# Altium schematic sheet Sheet1.SchDoc
size A4; SheetNumber: 1; SheetTotal: 2
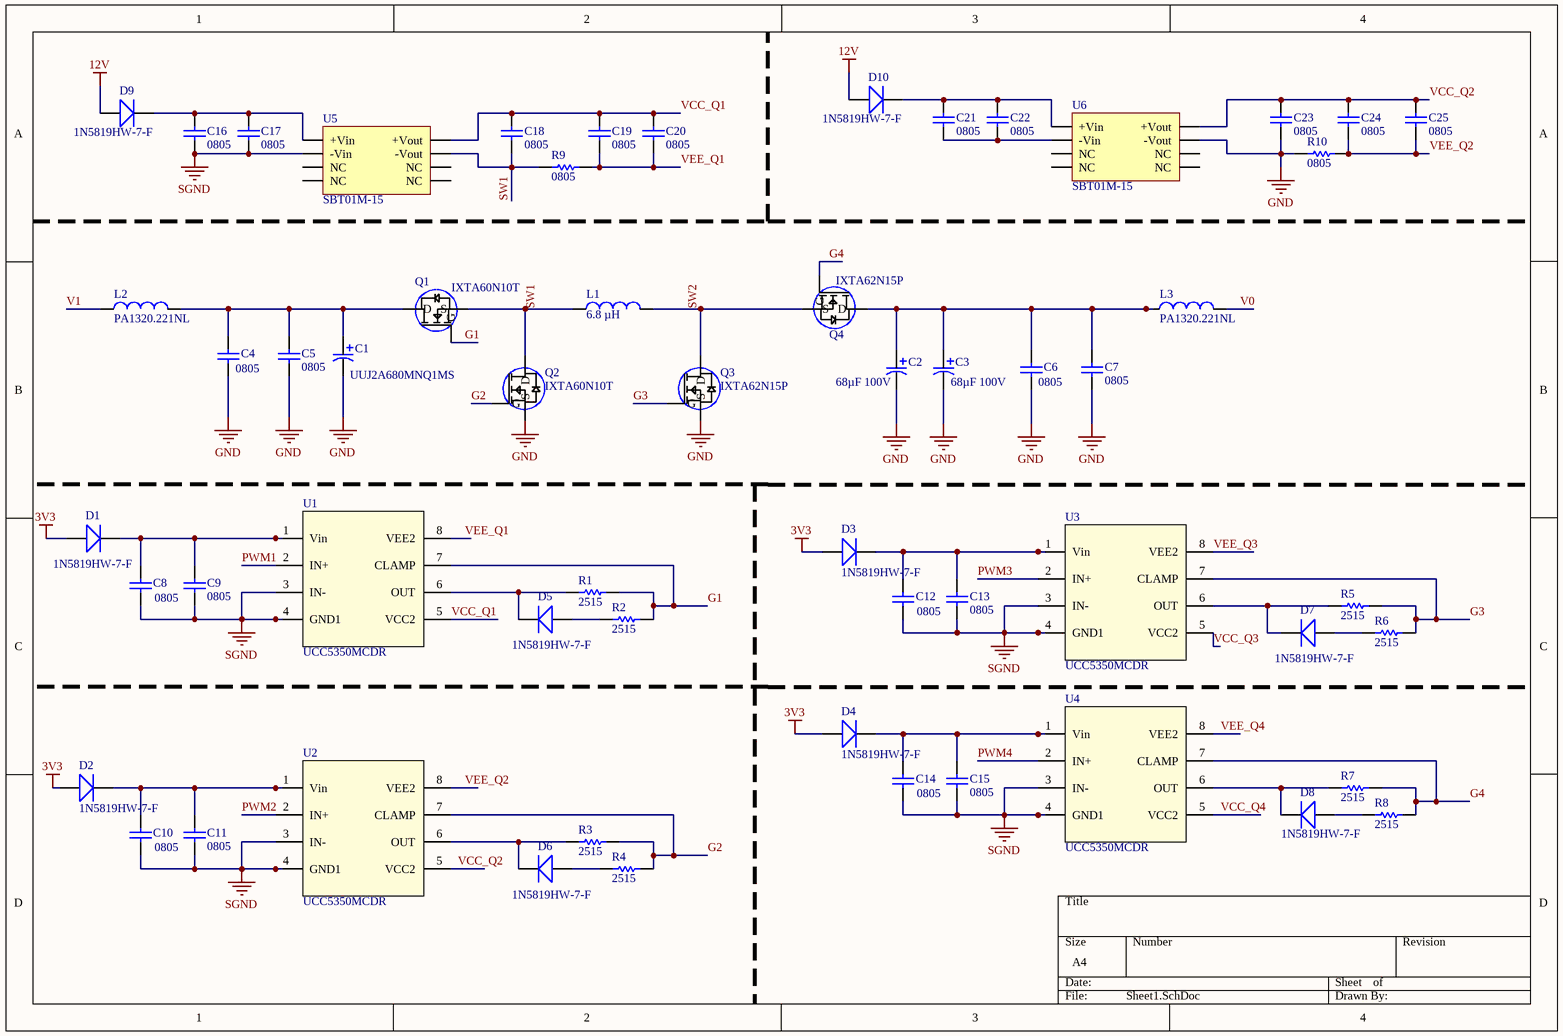
[diagram p0: Sheet1.SchDoc]

## Parts
C1  UUJ2A680MNQ1MS  [UUJ2A680MNQ1MS]
C2  68µF 100V  [UUJ2A680MNQ1MS]
C3  68µF 100V  [UUJ2A680MNQ1MS]
C4  0805  [0805 CAPACITOR]
C5  0805  [0805 CAPACITOR]
C6  0805  [0805 CAPACITOR]
C7  0805  [0805 CAPACITOR]
C8  0805  [0805 CAPACITOR]
C9  0805  [0805 CAPACITOR]
C10  0805  [0805 CAPACITOR]
C11  0805  [0805 CAPACITOR]
C12  0805  [0805 CAPACITOR]
C13  0805  [0805 CAPACITOR]
C14  0805  [0805 CAPACITOR]
C15  0805  [0805 CAPACITOR]
C16  0805  [0805 CAPACITOR]
C17  0805  [0805 CAPACITOR]
C18  0805  [0805 CAPACITOR]
C19  0805  [0805 CAPACITOR]
C20  0805  [0805 CAPACITOR]
C21  0805  [0805 CAPACITOR]
C22  0805  [0805 CAPACITOR]
C23  0805  [0805 CAPACITOR]
C24  0805  [0805 CAPACITOR]
C25  0805  [0805 CAPACITOR]
D1  1N5819HW-7-F  [1N5819HW-7-F_DIO-M]
D2  1N5819HW-7-F  [1N5819HW-7-F_DIO-M]
D3  1N5819HW-7-F  [1N5819HW-7-F_DIO-M]
D4  1N5819HW-7-F  [1N5819HW-7-F_DIO-M]
D5  1N5819HW-7-F  [1N5819HW-7-F_DIO-M]
D6  1N5819HW-7-F  [1N5819HW-7-F_DIO-M]
D7  1N5819HW-7-F  [1N5819HW-7-F_DIO-M]
D8  1N5819HW-7-F  [1N5819HW-7-F_DIO-M]
D9  1N5819HW-7-F  [1N5819HW-7-F_DIO-M]
D10  1N5819HW-7-F  [1N5819HW-7-F_DIO-M]
L1  6.8 µH  [MPX1D2213L6R8]
L2  PA1320.221NL  [PA1320.221NL]
L3  PA1320.221NL  [PA1320.221NL]
Q1  IXTA60N10T  [IXTA62N15P]
Q2  IXTA60N10T  [IXTA62N15P]
Q3  IXTA62N15P  [IXTA62N15P]
Q4  IXTA62N15P  [IXTA62N15P]
R1  2515  [2512 RESISTOR]
R2  2515  [2512 RESISTOR]
R3  2515  [2512 RESISTOR]
R4  2515  [2512 RESISTOR]
R5  2515  [2512 RESISTOR]
R6  2515  [2512 RESISTOR]
R7  2515  [2512 RESISTOR]
R8  2515  [2512 RESISTOR]
R9  0805  [0805 RESISTOR]
R10  0805  [0805 RESISTOR]
U1  UCC5350MCDR  [UCC5350MCDR]
U2  UCC5350MCDR  [UCC5350MCDR]
U3  UCC5350MCDR  [UCC5350MCDR]
U4  UCC5350MCDR  [UCC5350MCDR]
U5  SBT01M-15  [SBT01M-15]
U6  SBT01M-15  [SBT01M-15]

## Nets
3V3: D1.1 D2.1 D3.1 D4.1
12V: D9.1 D10.1
GND: C1.2 C2.2 C3.2 C4.2 C5.1 C6.2 C7.1 C23.1 Q2.3(S) Q3.3(S) R10.1 U6.4(-Vout)
SGND: C8.1 C9.1 C10.1 C11.1 C12.1 C13.1 C14.1 C15.1 C16.2 C17.1 U1.3(IN-) U1.4(GND1) U2.3(IN-) U2.4(GND1) U3.3(IN-) U3.4(GND1) U4.3(IN-) U4.4(GND1) U5.1(-Vin)
G1: Q1.1(G) R1.2 R2.2 U1.7(CLAMP)
G2: Q2.1(G) R3.2 R4.2 U2.7(CLAMP)
G3: Q3.1(G) R5.2 R6.2 U3.7(CLAMP)
G4: Q4.1(G) R7.2 R8.2 U4.7(CLAMP)
PWM1: U1.2(IN+)
PWM2: U2.2(IN+)
PWM3: U3.2(IN+)
PWM4: U4.2(IN+)
SW1: C18.1 L1.1 Q1.3(S) Q2.2(D) R9.1 U5.4(-Vout)
SW2: L1.2 Q3.2(D) Q4.3(S)
V0: L3.2
V1: L2.1
VCC_Q1: C18.2 C19.2 C20.2 U1.5(VCC2) U5.5(+Vout)
VCC_Q2: C23.2 C24.2 C25.2 U2.5(VCC2) U6.5(+Vout)
VCC_Q3: U3.5(VCC2)
VCC_Q4: U4.5(VCC2)
VEE_Q1: C19.1 C20.1 R9.2 U1.8(VEE2)
VEE_Q2: C24.1 C25.1 R10.2 U2.8(VEE2)
VEE_Q3: U3.8(VEE2)
VEE_Q4: U4.8(VEE2)
NetC1_1: C1.1 C4.1 C5.2 L2.2 Q1.2(D)
NetC2_1: C2.1 C3.1 C6.1 C7.2 L3.1 Q4.2(D)
NetC8_2: C8.2 C9.2 D1.2 U1.1(Vin)
NetC10_2: C10.2 C11.2 D2.2 U2.1(Vin)
NetC12_2: C12.2 C13.2 D3.2 U3.1(Vin)
NetC14_2: C14.2 C15.2 D4.2 U4.1(Vin)
NetC16_1: C16.1 C17.2 D9.2 U5.2(+Vin)
NetC21_1: C21.1 C22.2 D10.2 U6.2(+Vin)
NetC21_2: C21.2 C22.1 U6.1(-Vin)
NetD5_1: D5.1 R2.1
NetD5_2: D5.2 R1.1 U1.6(OUT)
NetD6_1: D6.1 R4.1
NetD6_2: D6.2 R3.1 U2.6(OUT)
NetD7_1: D7.1 R6.1
NetD7_2: D7.2 R5.1 U3.6(OUT)
NetD8_1: D8.1 R8.1
NetD8_2: D8.2 R7.1 U4.6(OUT)

Not connected (* = marked no-connect by the designer): U5 3(NC) 6(NC) 7(NC) 8(NC); U6 3(NC) 6(NC) 7(NC) 8(NC)

## Library data of the parts
C1-C3 = UUJ2A680MNQ1MS: 68µF 100V Aluminum Electrolytic Capacitors
C4 C6 = 0805CAP: 1UF 100V CAP CER  X7S 0805
C5 C7 = 0805CAP_1: 0.1UF 100V CAP CER X5R 0402
C8-C25 = 0805 CAPACITANCE: 4.7UF 100V CAP CER  X7S 0805
D1-D10 = 1N5819HW-7-F: 40V 1A DIODE SCHOTTKY
L1 = 6.8 µH Shielded Wirewound Inductor: 6.8UH 39A 3.3 MOHM SMD
Q1 Q2 = IXTA60N10T: N-Channel 100 V 60A (Tc) 176W (Tc) Surface Mount TO-263AA
Q3 Q4 = IXTA62N15P: N-Channel 150 V 62A (Tc) 350W (Tc) Surface Mount TO-263AA
R1-R8 = 2515 RESISTOR: 10 OHM RES SMD 10 OHM 5% 1W 2512
R9 R10 = 0805 RESISTOR: 1K OHM 16V
U1-U4 = UCC5350MCDR: No Description Available